# EAGLE design BSPD_Final_1 (EAGLE 9.6.2)
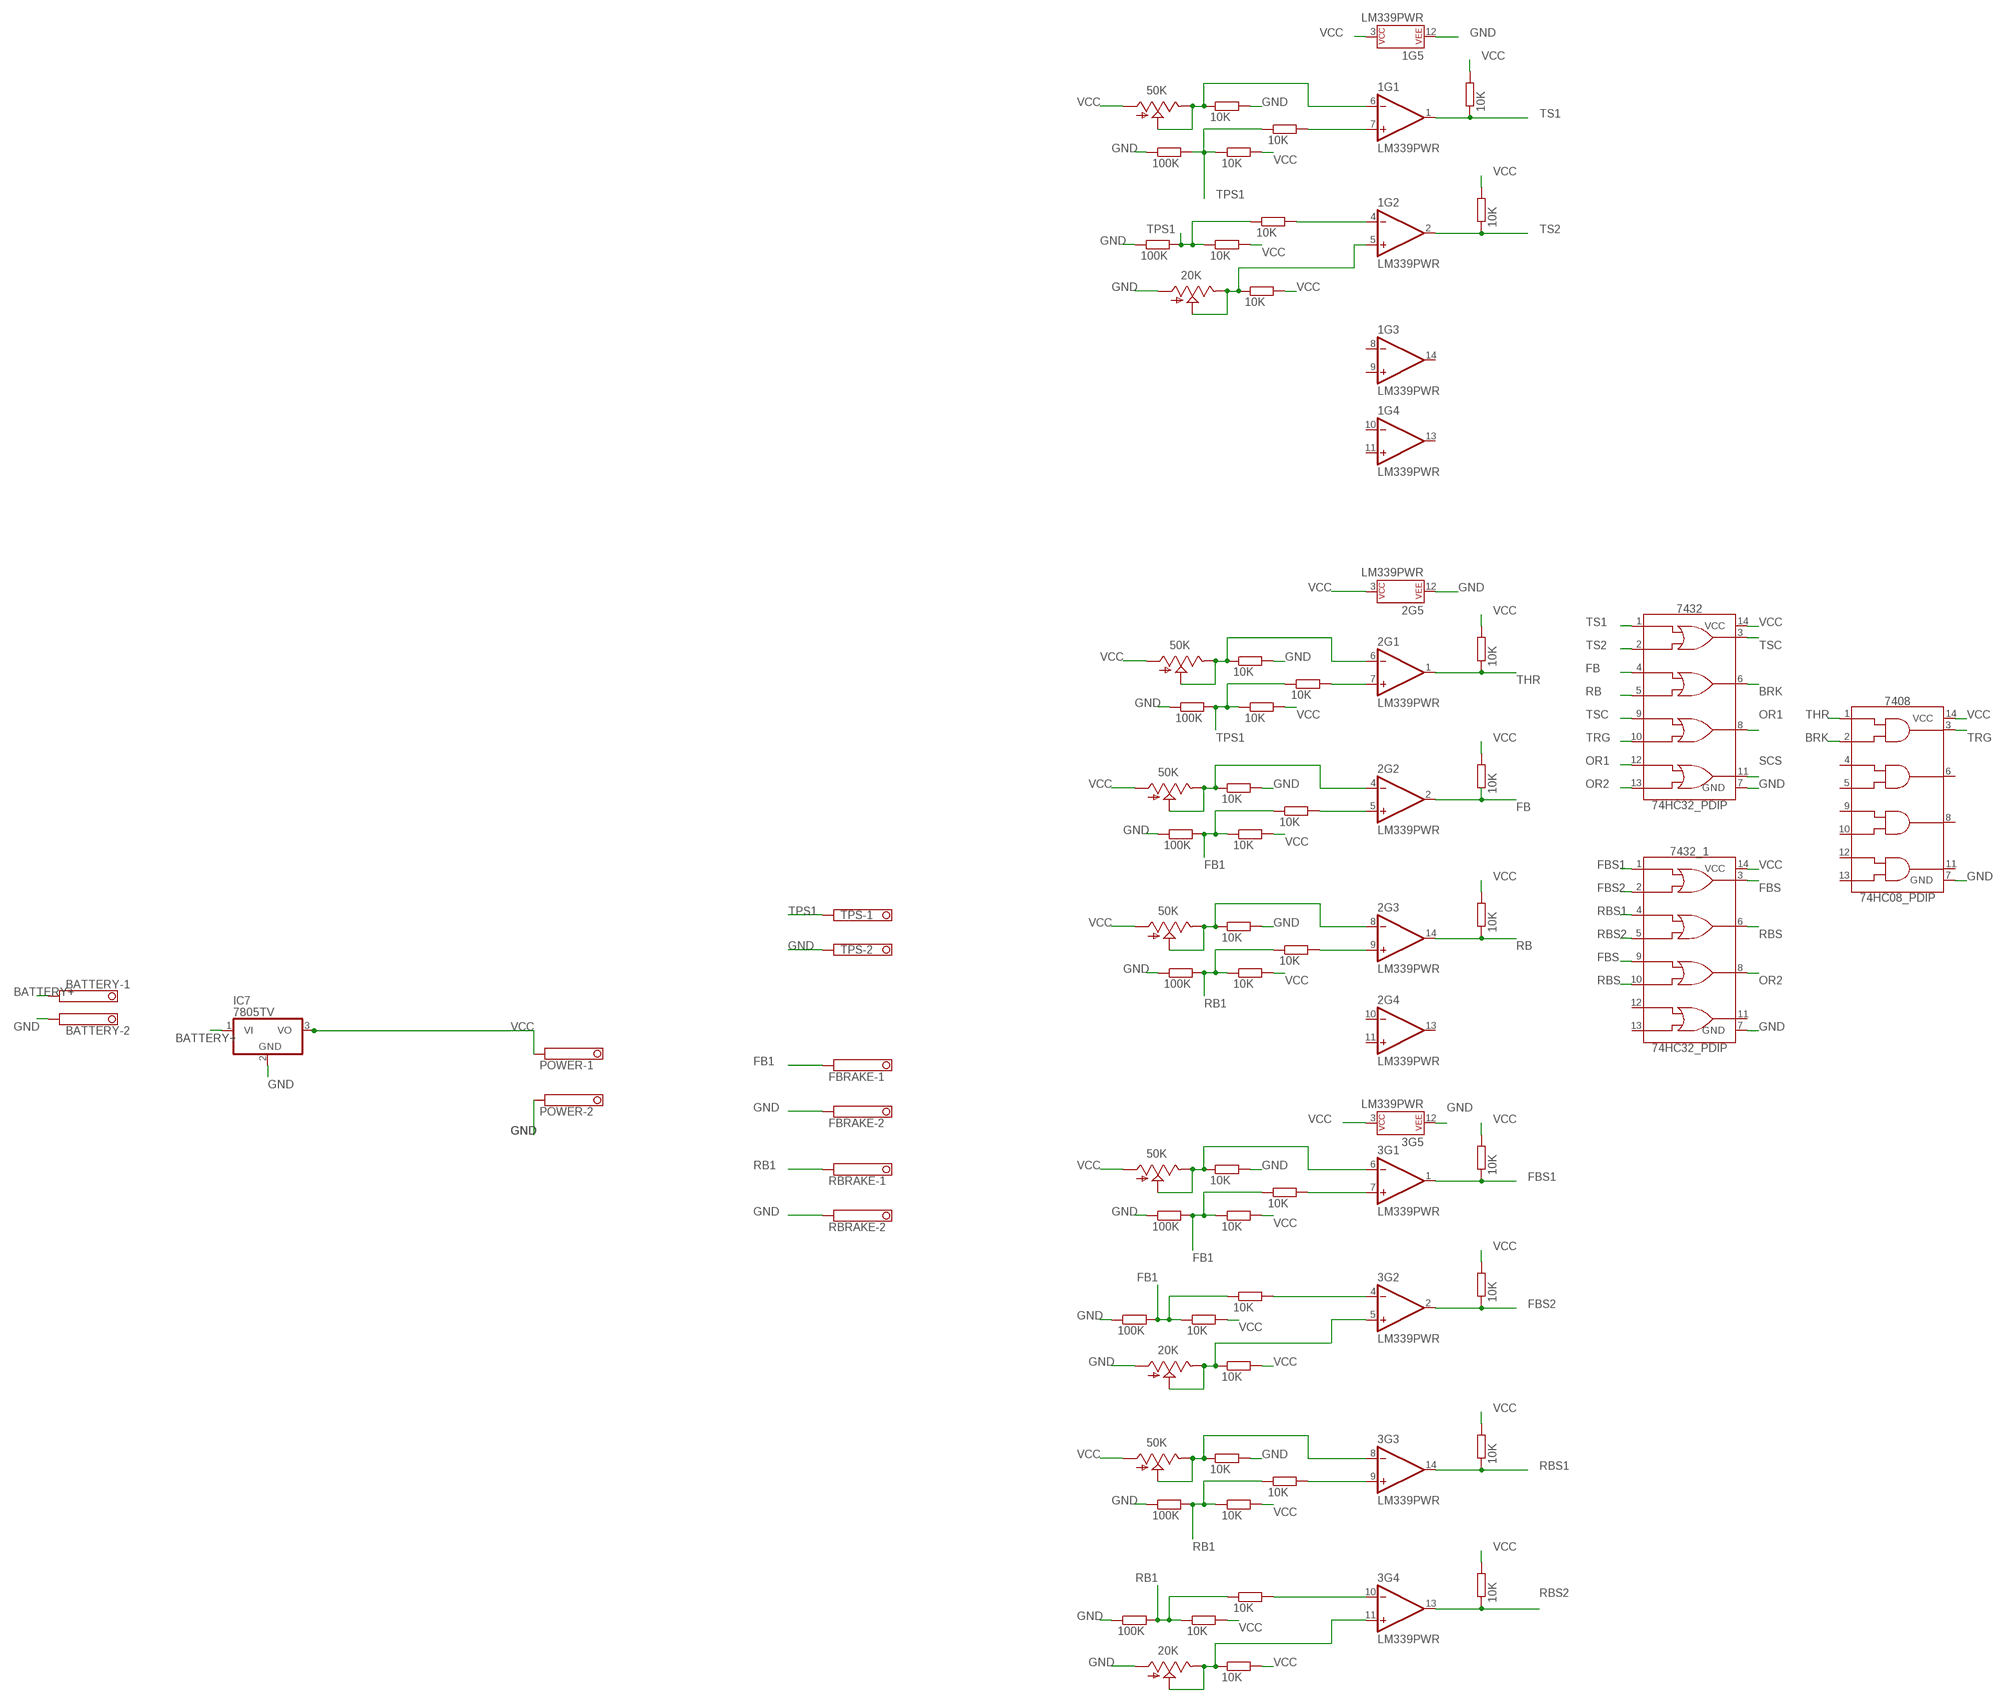
[diagram p0: schematic, sheet 1, part 1 of 2]
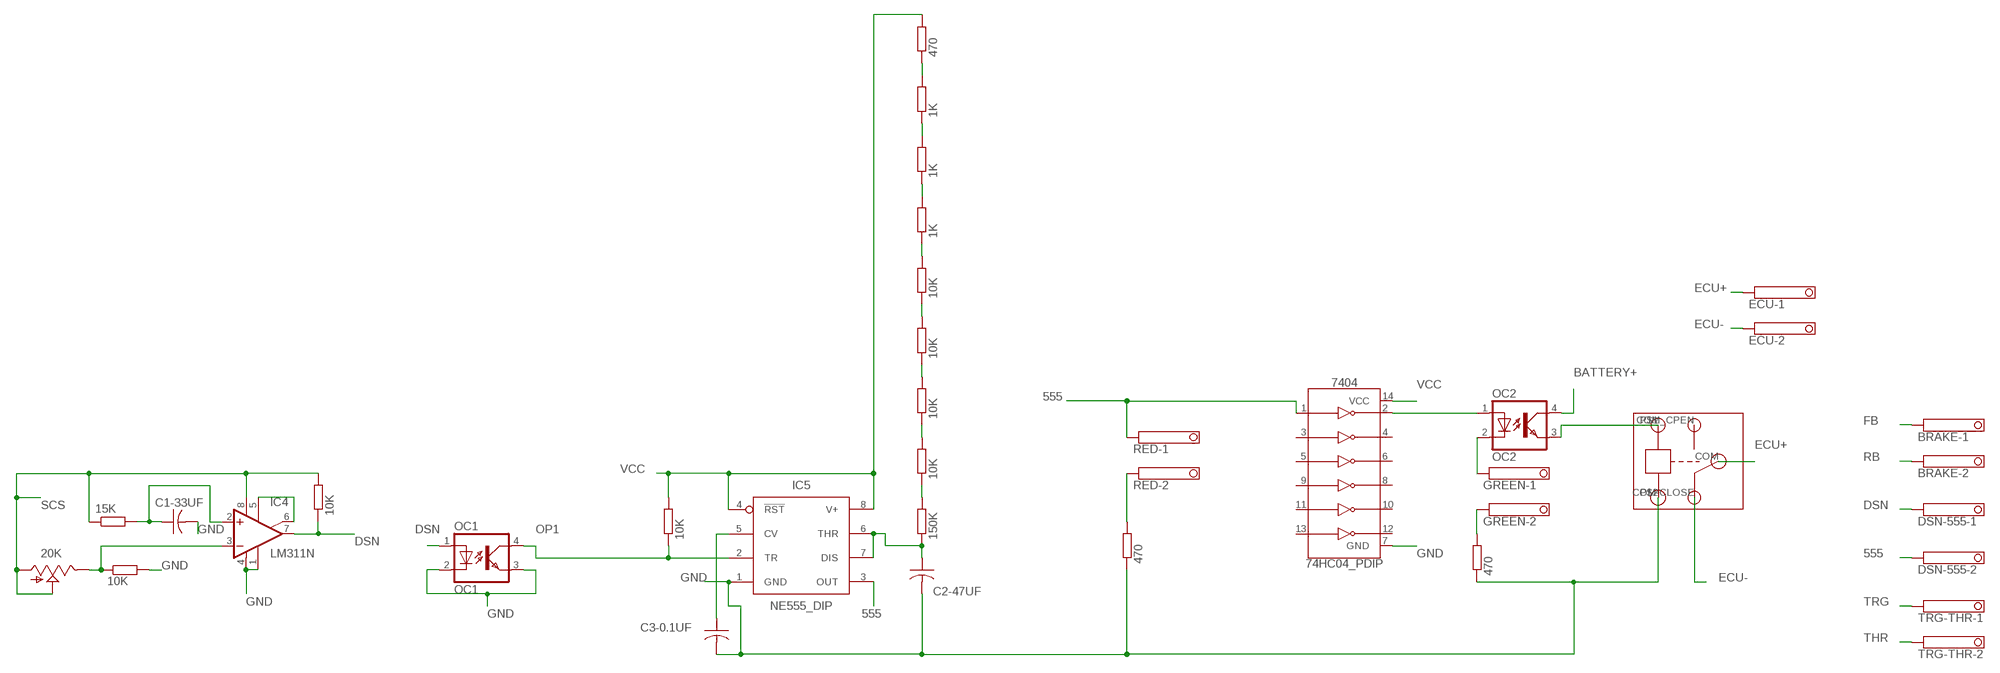
[diagram p1: schematic, sheet 1, part 2 of 2]

## Parts
1  LM339PWR  LM339  [TSSOP-14]
2  LM339PWR  LM339  [TSSOP-14]
3  LM339PWR  LM339  [TSSOP-14]
50K9  20K  TRIM_US-B64Y  [B64Y]
555RES1  150K  R-EU_0207/10  [0207/10]
555RES2  10K  R-EU_0207/10  [0207/10]
555RES3  10K  R-EU_0207/10  [0207/10]
555RES4  10K  R-EU_0207/10  [0207/10]
555RES5  10K  R-EU_0207/10  [0207/10]
555RES6  1K  R-EU_0207/10  [0207/10]
555RES7  1K  R-EU_0207/10  [0207/10]
555RES8  1K  R-EU_0207/10  [0207/10]
555RES9  470  R-EU_0207/10  [0207/10]
7404  74HC04_PDIP  [DIP762W53P254L1969H508Q14B]
7408  74HC08_PDIP  [DIP762W53P254L1969H508Q14B]
7432  74HC32_PDIP  [DIP762W53P254L1969H508Q14B]
7432_1  74HC32_PDIP  [DIP762W53P254L1969H508Q14B]
BATTERY  TERMINAL-BLOCK-3.5MM-2-PIN-ROUND-PAD  [TERMINAL-BLOCK-2-PIN-3.5MM-ROUND-PAD]
BRAKE  TERMINAL-BLOCK-3.5MM-2-PIN-ROUND-PAD  [TERMINAL-BLOCK-2-PIN-3.5MM-ROUND-PAD]
C1-33UF  33uF  ECA-1HM220  [CAP_RADIAL_2MM]
C2-47UF  33uF  ECA-1HM220  [CAP_RADIAL_2MM]
C3-0.1UF  33uF  ECA-1HM220  [CAP_RADIAL_2MM]
DCNPULL  10K  R-EU_0207/10  [0207/10]
DCNRES1  15K  R-EU_0207/10  [0207/10]
DCNRES2  10K  R-EU_0207/10  [0207/10]
DSN-555  TERMINAL-BLOCK-3.5MM-2-PIN-ROUND-PAD  [TERMINAL-BLOCK-2-PIN-3.5MM-ROUND-PAD]
ECU  TERMINAL-BLOCK-3.5MM-2-PIN-ROUND-PAD  [TERMINAL-BLOCK-2-PIN-3.5MM-ROUND-PAD]
FBRAKE  TERMINAL-BLOCK-3.5MM-2-PIN-ROUND-PAD  [TERMINAL-BLOCK-2-PIN-3.5MM-ROUND-PAD]
GREEN  TERMINAL-BLOCK-3.5MM-2-PIN-ROUND-PAD  [TERMINAL-BLOCK-2-PIN-3.5MM-ROUND-PAD]
IC4  LM311N  [DIL08]
IC5  NE555_DIP  [DIP826W53P254L959H508Q8B]
IC7  7805TV  [TO220V]
OC1  OC1  PC817  [DIL04]
OC2  OC2  PC817  [DIL04]
OCTPULL  10K  R-EU_0207/10  [0207/10]
POT1  50K  TRIM_US-B64Y  [B64Y]
POT2  20K  TRIM_US-B64Y  [B64Y]
POT3  50K  TRIM_US-B64Y  [B64Y]
POT4  50K  TRIM_US-B64Y  [B64Y]
POT5  50K  TRIM_US-B64Y  [B64Y]
POT6  50K  TRIM_US-B64Y  [B64Y]
POT7  20K  TRIM_US-B64Y  [B64Y]
POT8  50K  TRIM_US-B64Y  [B64Y]
POT9  20K  TRIM_US-B64Y  [B64Y]
POWER  TERMINAL-BLOCK-3.5MM-2-PIN-ROUND-PAD  [TERMINAL-BLOCK-2-PIN-3.5MM-ROUND-PAD]
PULL1  10K  R-EU_0207/10  [0207/10]
PULL2  10K  R-EU_0207/10  [0207/10]
PULL3  10K  R-EU_0207/10  [0207/10]
PULL4  10K  R-EU_0207/10  [0207/10]
PULL5  10K  R-EU_0207/10  [0207/10]
PULL6  10K  R-EU_0207/10  [0207/10]
PULL7  10K  R-EU_0207/10  [0207/10]
PULL8  10K  R-EU_0207/10  [0207/10]
PULL9  10K  R-EU_0207/10  [0207/10]
R56  470  R-EU_0207/10  [0207/10]
R57  470  R-EU_0207/10  [0207/10]
RBRAKE  TERMINAL-BLOCK-3.5MM-2-PIN-ROUND-PAD  [TERMINAL-BLOCK-2-PIN-3.5MM-ROUND-PAD]
RED  TERMINAL-BLOCK-3.5MM-2-PIN-ROUND-PAD  [TERMINAL-BLOCK-2-PIN-3.5MM-ROUND-PAD]
RES11  10K  R-EU_0207/10  [0207/10]
RES12  10K  R-EU_0207/10  [0207/10]
RES13  100K  R-EU_0207/10  [0207/10]
RES14  10K  R-EU_0207/10  [0207/10]
RES21  10K  R-EU_0207/10  [0207/10]
RES22  10K  R-EU_0207/10  [0207/10]
RES23  10K  R-EU_0207/10  [0207/10]
RES24  100K  R-EU_0207/10  [0207/10]
RES31  10K  R-EU_0207/10  [0207/10]
RES32  10K  R-EU_0207/10  [0207/10]
RES33  100K  R-EU_0207/10  [0207/10]
RES34  10K  R-EU_0207/10  [0207/10]
RES41  10K  R-EU_0207/10  [0207/10]
RES42  10K  R-EU_0207/10  [0207/10]
RES43  100K  R-EU_0207/10  [0207/10]
RES44  10K  R-EU_0207/10  [0207/10]
RES51  10K  R-EU_0207/10  [0207/10]
RES52  10K  R-EU_0207/10  [0207/10]
RES53  100K  R-EU_0207/10  [0207/10]
RES54  10K  R-EU_0207/10  [0207/10]
RES61  10K  R-EU_0207/10  [0207/10]
RES62  10K  R-EU_0207/10  [0207/10]
RES63  100K  R-EU_0207/10  [0207/10]
RES64  10K  R-EU_0207/10  [0207/10]
RES71  10K  R-EU_0207/10  [0207/10]
RES72  10K  R-EU_0207/10  [0207/10]
RES73  100K  R-EU_0207/10  [0207/10]
RES74  10K  R-EU_0207/10  [0207/10]
RES81  10K  R-EU_0207/10  [0207/10]
RES82  10K  R-EU_0207/10  [0207/10]
RES83  100K  R-EU_0207/10  [0207/10]
RES84  10K  R-EU_0207/10  [0207/10]
RES91  10K  R-EU_0207/10  [0207/10]
RES92  10K  R-EU_0207/10  [0207/10]
RES93  100K  R-EU_0207/10  [0207/10]
RES94  10K  R-EU_0207/10  [0207/10]
TPS  TERMINAL-BLOCK-3.5MM-2-PIN-ROUND-PAD  [TERMINAL-BLOCK-2-PIN-3.5MM-ROUND-PAD]
TRG-THR  TERMINAL-BLOCK-3.5MM-2-PIN-ROUND-PAD  [TERMINAL-BLOCK-2-PIN-3.5MM-ROUND-PAD]
U$1  RELAY  [RELAY]

## Nets
555: 7404.1(1A) DSN-555.2 IC5.3(OUT) RED.1
BATTERY+: BATTERY.1 IC7.1(VI) OC2.4(COL)
BRK: 7408.2(1B) 7432.6(2Y)
DSN: DCNPULL.1 DSN-555.1 IC4.7(OUT) OC1.1(A)
ECU+: ECU.1 U$1.COM
ECU-: ECU.2 U$1.COM-CLOSE
FB: 2.2(OUT) 7432.4(2A) BRAKE.1 PULL4.1
FB1: FBRAKE.1 RES41.1 RES42.1 RES43.2 RES61.1 RES62.1 RES63.2 RES71.1 RES72.1 RES73.2
FBS: 7432_1.3(1Y) 7432_1.9(3A)
FBS1: 3.1(OUT) 7432_1.1(1A) PULL6.1
FBS2: 3.2(OUT) 7432_1.2(1B) PULL7.1
GND: 1.12(P$V-) 2.12(P$V-) 3.12(P$V-) 7404.7(GND) 7408.7(GND) 7432.7(GND) 7432_1.7(GND) BATTERY.2 C1-33UF.2 C2-47UF.2 C3-0.1UF.2 DCNRES2.2 FBRAKE.2 IC4.1(GND) IC4.4(V-) IC5.1(GND) IC7.2(GND) OC1.2(C) OC1.3(EMIT) POT2.A POT7.A POT9.A POWER.2 R56.1 R57.1 RBRAKE.2 RES13.1 RES14.2 RES24.1 RES33.1 RES34.2 RES43.1 RES44.2 RES53.1 RES54.2 RES63.1 RES64.2 RES73.1 RES83.1 RES84.2 RES93.1 TPS.2 U$1.P$2(GND)
N$1: 2.7(+IN) RES31.2
N$2: IC4.5(ON) IC4.6(ON/STR)
N$3: 2.6(-IN) POT3.E POT3.S RES34.1
N$4: 2.5(+IN) RES41.2
N$5: 2.4(-IN) POT4.E POT4.S RES44.1
N$6: R56.2 RED.2
N$7: 2.9(+IN) RES51.2
N$8: 2.8(-IN) POT5.E POT5.S RES54.1
N$9: C1-33UF.1 DCNRES1.2 IC4.2(+IN)
N$10: 3.7(+IN) RES61.2
N$11: 3.6(-IN) POT6.E POT6.S RES64.1
N$12: 50K9.E DCNRES2.1 IC4.3(-IN)
N$13: 3.9(+IN) RES81.2
N$14: 3.8(-IN) POT8.E POT8.S RES84.1
N$15: C3-0.1UF.1 IC5.5(CV)
N$16: 1.7(+IN) RES11.2
N$17: 1.6(-IN) POT1.E POT1.S RES14.1
N$19: 1.4(-IN) RES21.2
N$20: 1.5(+IN) POT2.E POT2.S RES23.1
N$21: 555RES1.2 555RES2.1
N$22: 3.4(-IN) RES71.2
N$23: 555RES2.2 555RES3.1
N$24: 3.5(+IN) POT7.E POT7.S RES74.1
N$25: 555RES3.2 555RES4.1
N$26: 3.10(-IN) RES91.2
N$27: 555RES4.2 555RES5.1
N$28: 3.11(+IN) POT9.E POT9.S RES94.1
N$29: 555RES5.2 555RES6.1
N$30: GREEN.2 R57.2
N$31: 7404.2(1Y) OC2.1(A)
N$32: GREEN.1 OC2.2(C)
N$33: OC2.3(EMIT) U$1.P$1(IN)
N$34: 555RES8.2 555RES9.1
N$35: 555RES7.2 555RES8.1
N$36: 555RES6.2 555RES7.1
N$38: 555RES1.1 C2-47UF.1 IC5.6(THR) IC5.7(DIS)
OP1: IC5.2(TR) OC1.4(COL) OCTPULL.1
OR1: 7432.8(3Y) 7432.12(4A)
OR2: 7432.13(4B) 7432_1.8(3Y)
RB: 2.14(OUT) 7432.5(2B) BRAKE.2 PULL5.1
RB1: RBRAKE.1 RES51.1 RES52.1 RES53.2 RES81.1 RES82.1 RES83.2 RES91.1 RES92.1 RES93.2
RBS: 7432_1.6(2Y) 7432_1.10(3B)
RBS1: 3.14(OUT) 7432_1.4(2A) PULL8.1
RBS2: 3.13(OUT) 7432_1.5(2B) PULL9.1
SCS: 50K9.A 50K9.S 7432.11(4Y) DCNPULL.2 DCNRES1.1 IC4.8(V+)
THR: 2.1(OUT) 7408.1(1A) PULL3.1 TRG-THR.2
TPS1: RES11.1 RES12.1 RES13.2 RES21.1 RES22.1 RES24.2 RES31.1 RES32.1 RES33.2 TPS.1
TRG: 7408.3(1Y) 7432.10(3B) TRG-THR.1
TS1: 1.1(OUT) 7432.1(1A) PULL1.1
TS2: 1.2(OUT) 7432.2(1B) PULL2.1
TSC: 7432.3(1Y) 7432.9(3A)
VCC: 1.3(P$V+) 2.3(P$V+) 3.3(P$V+) 555RES9.2 7404.14(VCC) 7408.14(VCC) 7432.14(VCC) 7432_1.14(VCC) IC5.4(!RST) IC5.8(V+) IC7.3(VO) OCTPULL.2 POT1.A POT3.A POT4.A POT5.A POT6.A POT8.A POWER.1 PULL1.2 PULL2.2 PULL3.2 PULL4.2 PULL5.2 PULL6.2 PULL7.2 PULL8.2 PULL9.2 RES12.2 RES22.2 RES23.2 RES32.2 RES42.2 RES52.2 RES62.2 RES72.2 RES74.2 RES82.2 RES92.2 RES94.2
Unconnected: 1.8(-IN) 1.9(+IN) 1.10(-IN) 1.11(+IN) 1.13(OUT) 1.14(OUT) 2.10(-IN) 2.11(+IN) 2.13(OUT) 7404.3(2A) 7404.4(2Y) 7404.5(3A) 7404.6(3Y) 7404.8(4Y) 7404.9(4A) 7404.10(5Y) 7404.11(5A) 7404.12(6Y) 7404.13(6A) 7408.4(2A) 7408.5(2B) 7408.6(2Y) 7408.8(3Y) 7408.9(3A) 7408.10(3B) 7408.11(4Y) 7408.12(4A) 7408.13(4B) 7432_1.11(4Y) 7432_1.12(4A) 7432_1.13(4B) U$1.COM_CPEN(COM-OPEN)

## Library data of the parts
1-3 = SparkFun-IC-Amplifiers:LM339: Quad Comparator - LM339PWR Based on information from the SLCS006N datasheet from TI (www.ti.com). Created by nick@scantool.net, 2008. Updated 2016. SparkFun Products SparkFun OBD-II UART <https://www.sparkfun.com/products/9555> (WIG-09555) SparkFun Car Diagnostics Kit <https://www.sparkfun.com/products/10769> (RTL-10769); PROD_ID: IC-09990
50K9 POT1-POT9 = pot:TRIM_US-: POTENTIOMETER
555RES1-555RES9 DCNPULL DCNRES1 DCNRES2 OCTPULL PULL1-PULL9 R56 R57 RES11-RES14 RES21-RES24 RES31-RES34 RES41-RES44 RES51-RES54 RES61-RES64 RES71-RES74 RES81-RES84 RES91-RES94 = rcl:R-EU_: RESISTOR, European symbol; SPICEPREFIX: R
7404 = IC_Logic:74HC04: Hex Inverters Reference Datasheet <https://www.ti.com/lit/ds/symlink/sn74hc04.pdf?ts=1637607731979&ref_url=https%253A%252F%252Fwww.google.com%252F>; CATEGORY: IC_Logic; DESCRIPTION: Hex Inverters; MANUFACTURER: Generic; MPN: Generic; SUB-CATEGORY: Inverter; TYPE: Hex
7408 = IC_Logic:74HC08: Quadruple 2-Input AND Gates Reference Datasheet <https://www.ti.com/lit/ds/symlink/sn74hc08.pdf?ts=1637607755453&ref_url=https%253A%252F%252Fwww.google.com%252F>; CATEGORY: IC_Logic; DESCRIPTION: Quadruple 2-Input AND Gates; MANUFACTURER: Generic; MPN: Generic; SUB-CATEGORY: GATE; TYPE: AND
7432 7432_1 = IC_Logic:74HC32: Quadruple 2-Input OR Gates Reference Datasheet <https://www.ti.com/lit/ds/symlink/sn54hc32-sp.pdf?ts=1637578080525&ref_url=https%253A%252F%252Fwww.google.com%252F>; CATEGORY: IC_Logic; DESCRIPTION: Quadruple 2-Input OR Gates; MANUFACTURER: Generic; MPN: Generic; SUB-CATEGORY: GATE; TYPE: OR
BATTERY BRAKE DSN-555 ECU FBRAKE GREEN POWER RBRAKE RED TRG-THR = Rembrandt Electronics - Terminal Block 3-5mm v1-0:TERMINAL-BLOCK-3.5MM-2-PIN: Terminal Block 3.5mm Pitch: 3,5 mm Number of pins: 2 Created by Rembrandt Electronics www.rembrandtelectronics.com
C1-33UF C2-47UF C3-0.1UF = Resistor_Capacitor:ECA-1HM220: CAP ALUM 22UF 20% 50V RADIAL Manufacturer's datasheet <https://media.digikey.com/pdf/Data%20Sheets/Panasonic%20Electronic%20Components/ECA-xxM%20Series,TypeA.pdf>; CREATED_BY: PCBLayout.com; DIGIKEY_PART_NUMBER: P5179-ND; MANUFACTURER: Panasonic Electronic Components; MPN: ECA-1HM220; PACKAGE: CAP RADIAL 2MM LS
IC4 = linear:LM311: COMPARATOR
IC5 = IC_Clock-Timing:*555: TIMER 555 General purpose precision timers NE555 : Texas Datasheet <http://www.ti.com/general/docs/suppproductinfo.tsp?distId=10&gotoUrl=http%3A%2F%2Fwww.ti.com%2Flit%2Fgpn%2Fne555>, Diodes Incorporated Datasheet <https://www.diodes.com/assets/Datasheets/NE555_SA555_NA555.pdf> LM555 Datasheet <http://www.ti.com/general/docs/suppproductinfo.tsp?distId=10&gotoUrl=http%3A%2F%2Fwww.ti.com%2Flit%2Fgpn%2Flm555> LMC555 Datasheet <http://www.ti.com/general/docs/suppproductinfo.tsp?distId=10&gotoUrl=http%3A%2F%2Fwww.ti.com%2Flit%2Fgpn%2Flmc555> ICM7555 : Maxim Integrated Datasheet <https://datasheets.maximintegrated.com/en/ds/ICM7555-ICM7556.pdf>, Renesas Electronics America Inc Datasheet <https://www.renesas.com/en-us/www/doc/datasheet/icm7555-56.pdf>; CATEGORY: IC_Clock-Timing; CURRENT-SUPPLY: 10mA; DESCRIPTION: IC OSC SINGLE TIMER 100KHZ 8-DIP; FREQUENCY: 100kHz; MANUFACTURER: Texas Instruments; MPN: NE555P; OPERATING_TEMP: 0°C to 70°C; PART_STATUS: Active; ROHS_COMPLIANT: ROHS3 Compliant; SUB-CATEGORY: Timer
IC7 = linear:78*: Positive VOLTAGE REGULATOR Source: http://cache.national.com/ds/LM/LM78L05.pdf http://www.fairchildsemi.com/ds/LM/LM7805.pdf
OC1 OC2 = optocoupler:PC817: SHARP OPTO COUPLER
TPS = Rembrandt_Electronics_-_Terminal_Block_3-5mm_v1-0:TERMINAL-BLOCK-3.5MM-2-PIN: Terminal Block 3.5mm Pitch: 3,5 mm Number of pins: 2 Created by Rembrandt Electronics www.rembrandtelectronics.com
U$1 = RELAY:RELAY

## Board
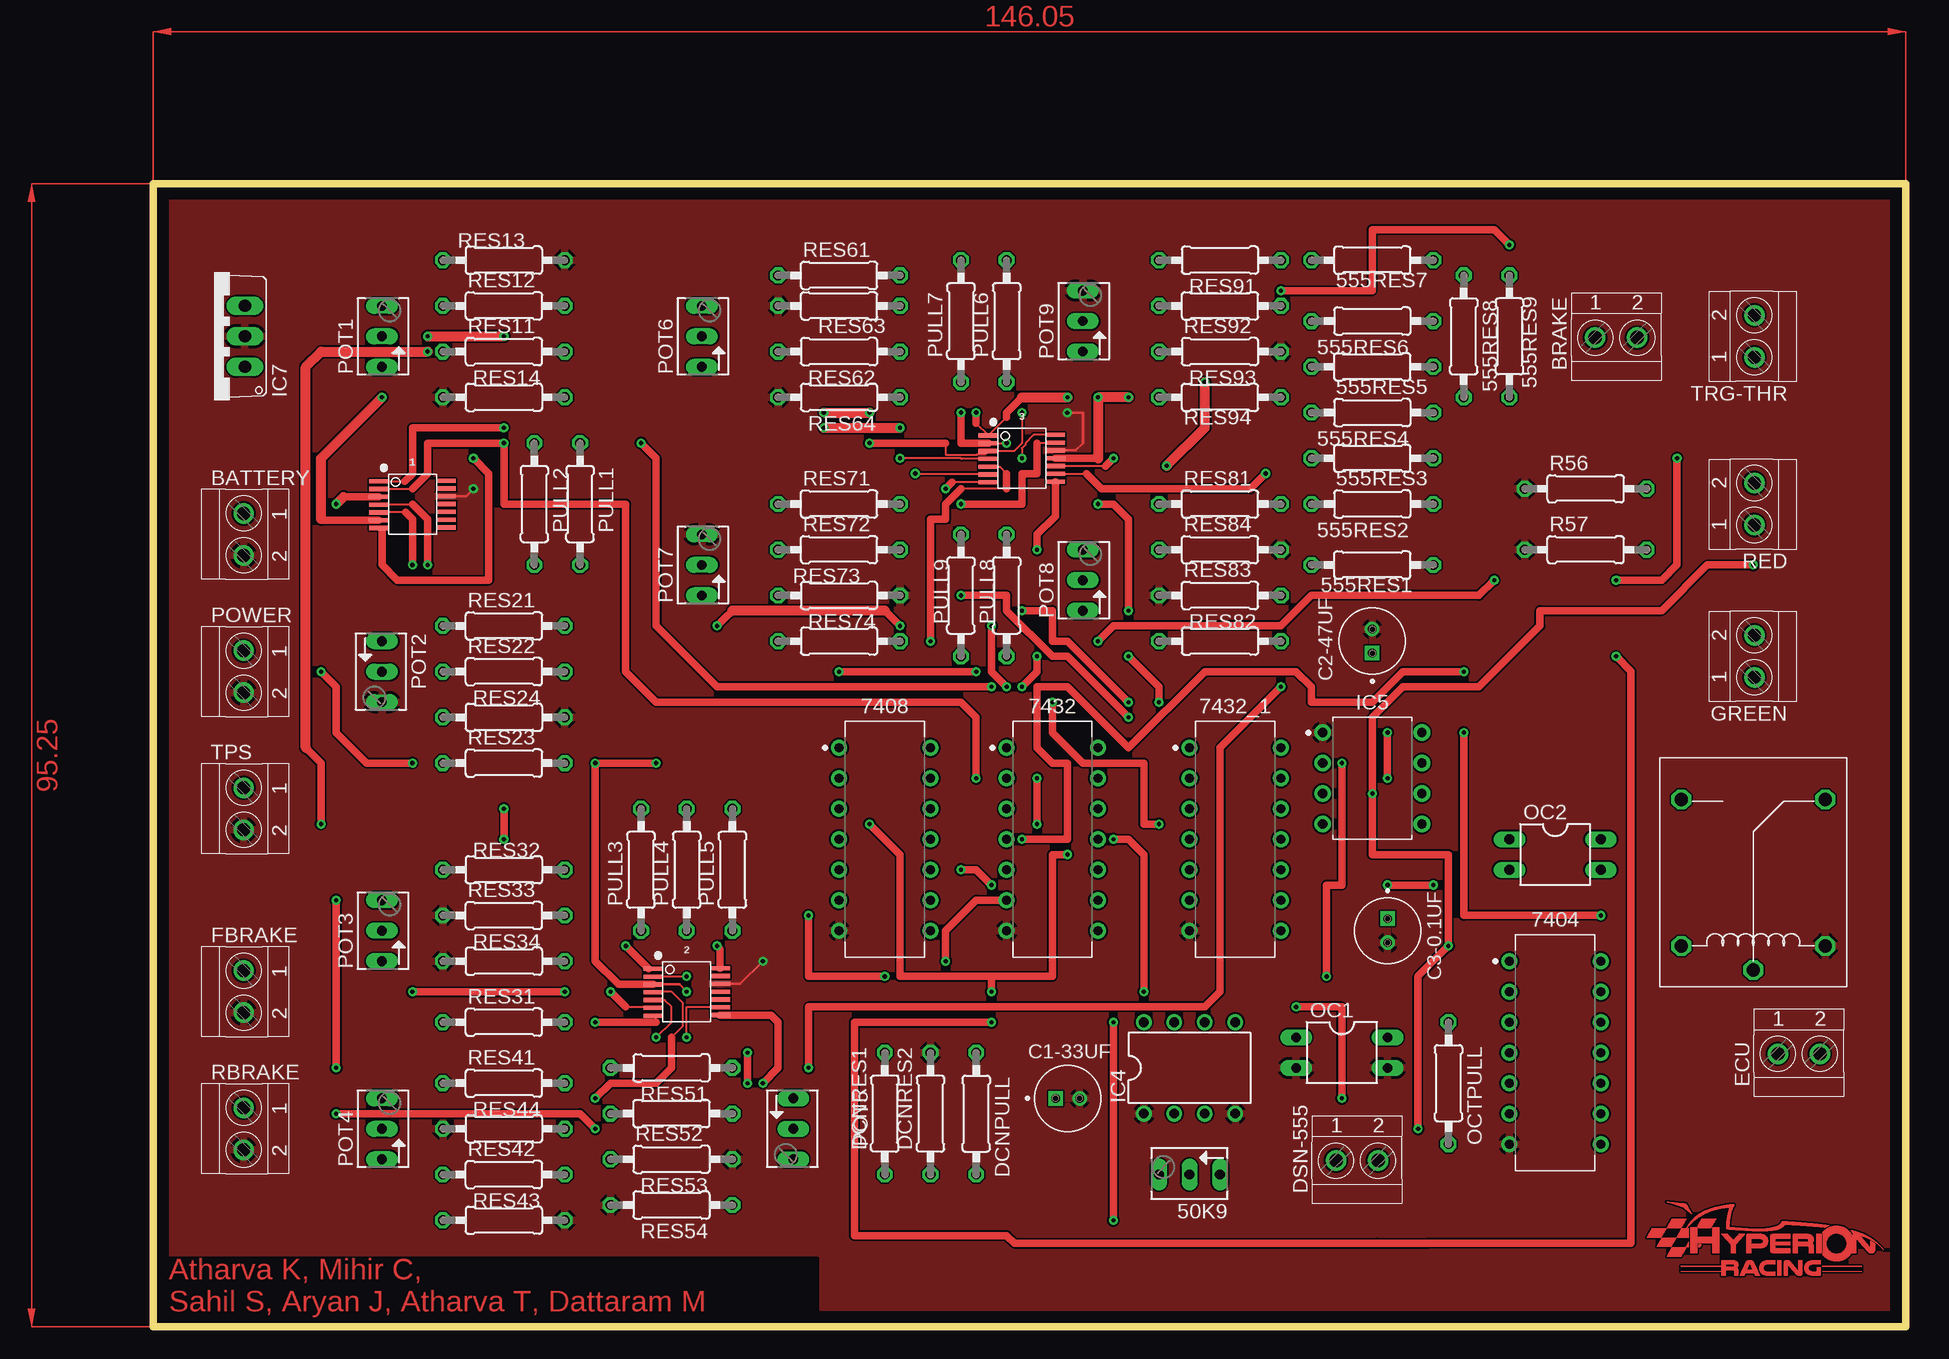
[diagram p2: board, top side]
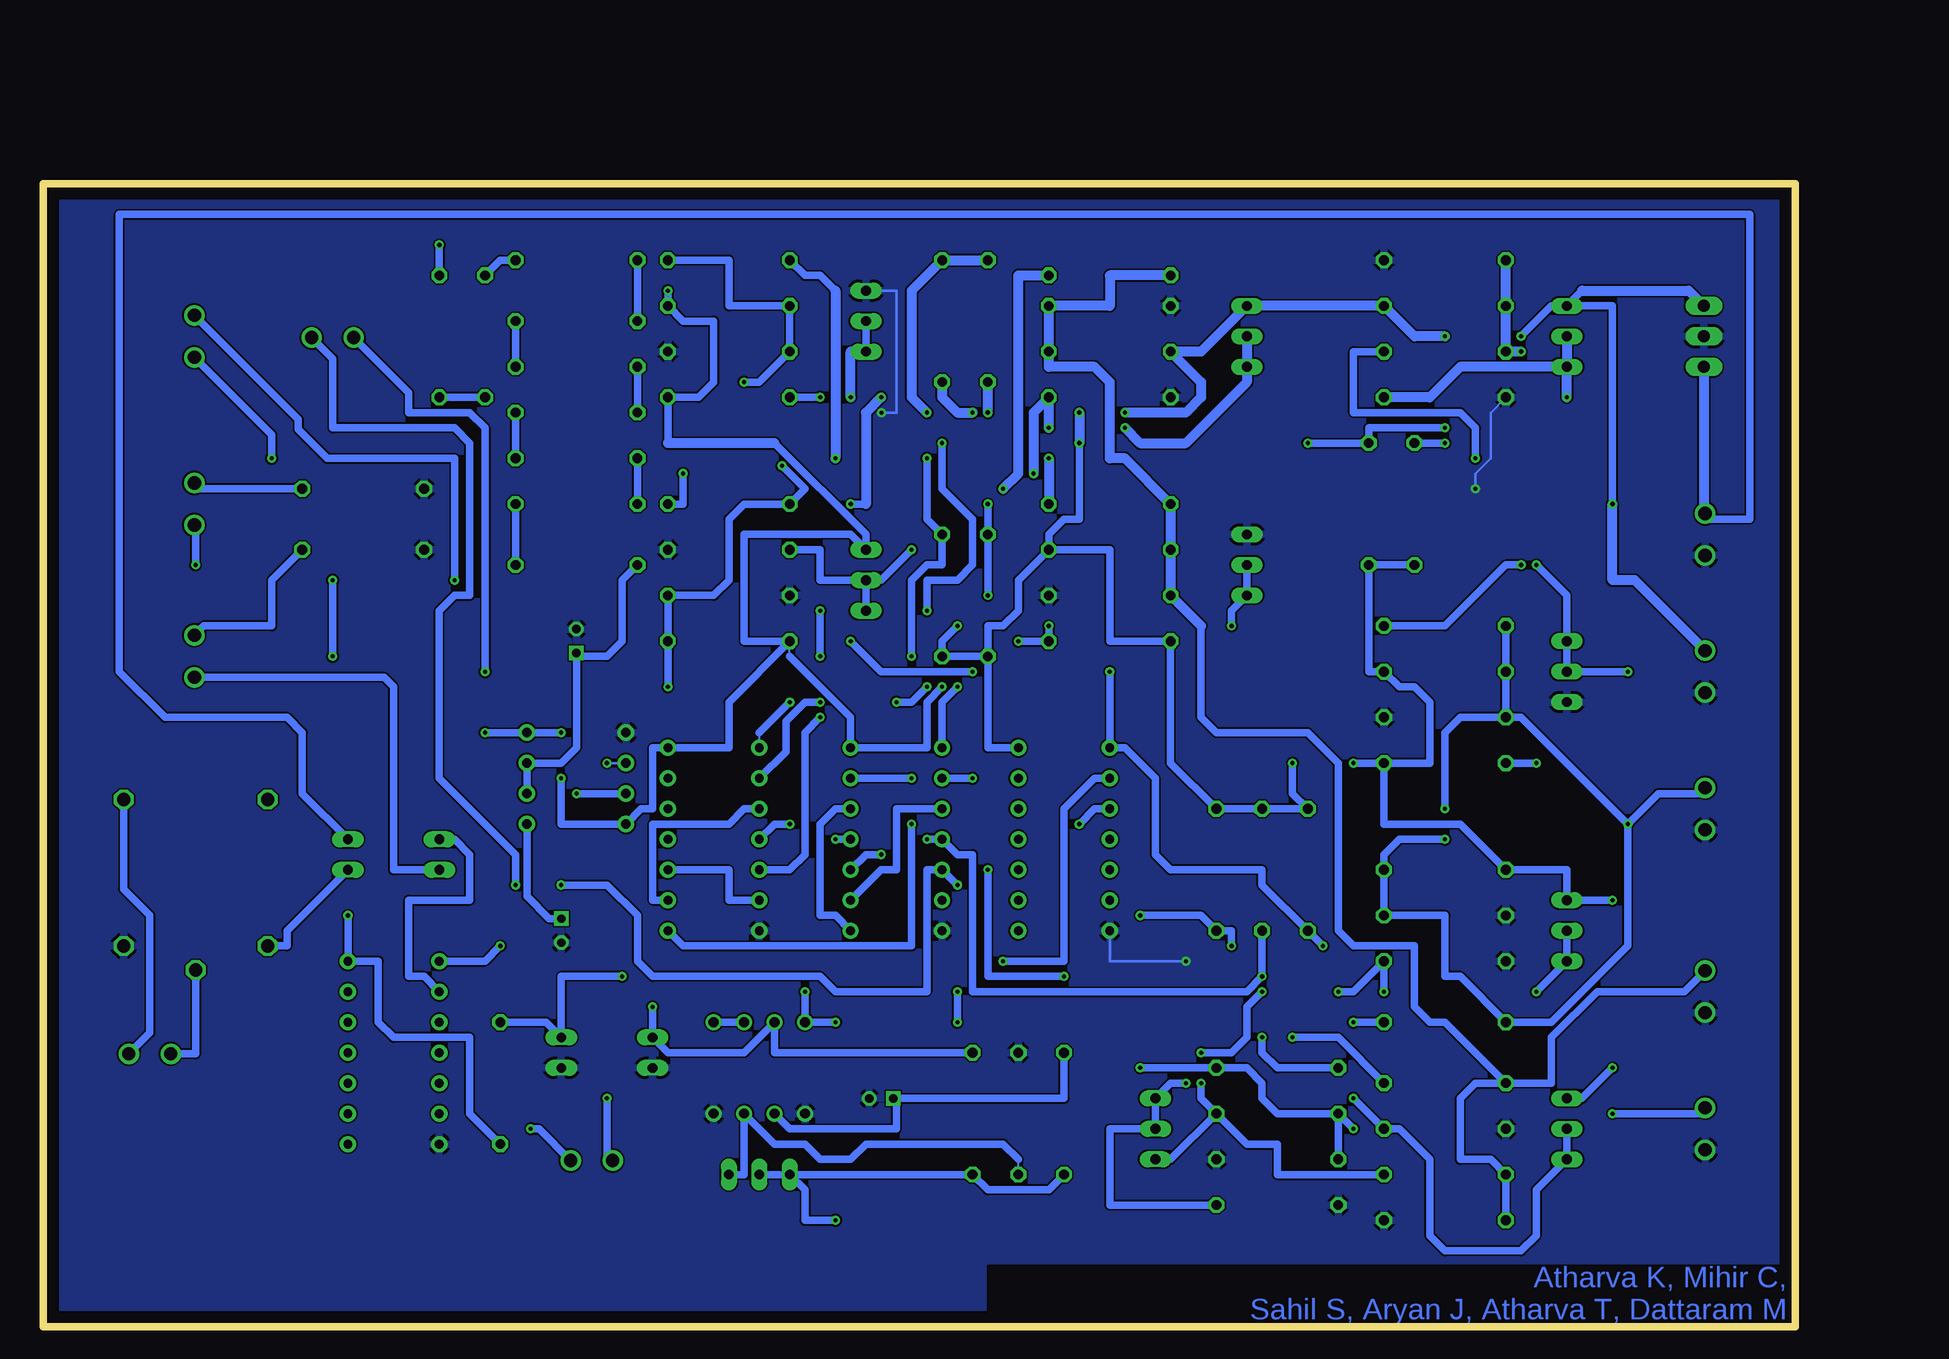
[diagram p3: board, bottom side, seen from below]

Size 146.05 x 95.25 mm. Coordinates in mm from the lower left corner, seen from the top.
Outline: 0,95.25 0,0 146.05,0 146.05,95.25 0,95.25
Copper layers (1*16): Top 0.035mm / dielectric 1.5mm / Bottom 0.035mm
Design rules "default": minimum track width 6mil, minimum drill 0.35mm, track to track 6mil, track to pad 6mil, pad to pad 6mil, via to via 6mil, smd to smd 6mil, copper to edge 40mil, drill to drill 6mil, minimum pad ring 10mil, minimum via ring 8mil, stop-mask expansion 4mil, vias tented up to drill 0mil, thermal gap 10mil

### Footprints (pad centres in the part's own frame; a part is rotated, then mirrored left to right if it is on the bottom)
TSSOP-14 = smd 1.6 x 0.35: 1 -2.8,1.9; 2 -2.8,1.25; 3 -2.8,0.6; 4 -2.8,-0.05; 5 -2.8,-0.7; 6 -2.8,-1.35; 7 -2.8,-2; 8 2.8,-1.95; 9 2.8,-1.3; 10 2.8,-0.65; 11 2.8,0; 12 2.8,0.65; 13 2.8,1.3; 14 2.8,1.95
B64Y = drill 0.813 long: A 2.54,0; E -2.54,0; S 0,0
0207/10 = drill 0.813 octagon: 1 -5.08,0; 2 5.08,0
DIP762W53P254L1969H508Q14B = drill 0.743 pad 1.343: 1 -3.81,7.62; 2 -3.81,5.08; 3 -3.81,2.54; 4 -3.81,0; 5 -3.81,-2.54; 6 -3.81,-5.08; 7 -3.81,-7.62; 8 3.81,-7.62; 9 3.81,-5.08; 10 3.81,-2.54; 11 3.81,0; 12 3.81,2.54; 13 3.81,5.08; 14 3.81,7.62
TERMINAL-BLOCK-2-PIN-3.5MM-ROUND-PAD = drill 1.1 pad 1.7: 1 -1.75,-0.1; 2 1.75,-0.1
CAP_RADIAL_2MM = drill 0.7 pad 1.1 square: 1 -1,0 | drill 0.7 pad 1.1: 2 1,0
DIL08 = drill 0.813 pad 1.27: 1 -3.81,-3.81; 2 -1.27,-3.81; 3 1.27,-3.81; 4 3.81,-3.81; 5 3.81,3.81; 6 1.27,3.81; 7 -1.27,3.81; 8 -3.81,3.81
DIP826W53P254L959H508Q8B = drill 0.786 pad 1.386: 1 -4.13,3.81; 2 -4.13,1.27; 3 -4.13,-1.27; 4 -4.13,-3.81; 5 4.13,-3.81; 6 4.13,-1.27; 7 4.13,1.27; 8 4.13,3.81
TO220V = drill 1.016 long: 1 -2.54,-2.54; 2 0,-2.54; 3 2.54,-2.54
DIL04 = drill 0.813 long: 1 -1.27,-3.81; 2 1.27,-3.81; 3 1.27,3.81; 4 -1.27,3.81
RELAY = drill 1.1 octagon: COM -2,0; COM-CLOSE 12.2,-6; COM_CPEN 12.2,6; P$1 0,6; P$2 0,-6

### Placement (x,y rotation side)
1  21.59,68.58 0 top
2  44.45,27.94 0 top
3  72.39,72.39 0 top
50K9  86.36,12.7 180 top
555RES1  101.6,63.5 0 top
555RES2  101.6,68.58 180 top
555RES3  101.6,72.39 0 top
555RES4  101.6,76.2 180 top
555RES5  101.6,80.01 0 top
555RES6  101.6,83.82 180 top
555RES7  101.6,88.9 0 top
555RES8  109.22,82.55 270 top
555RES9  113.03,82.55 90 top
7404  116.84,22.86 0 top
7408  60.96,40.64 0 top
7432  74.93,40.64 0 top
7432_1  90.17,40.64 0 top
BATTERY  7.62,66.04 270 top
BRAKE  121.92,82.55 0 top
C1-33UF  76.2,19.05 0 top
C2-47UF  101.6,57.15 90 top
C3-0.1UF  102.87,33.02 270 top
DCNPULL  68.58,17.78 270 top
DCNRES1  60.96,17.78 90 top
DCNRES2  64.77,17.78 90 top
DSN-555  100.33,13.97 0 top
ECU  137.16,22.86 0 top
FBRAKE  7.62,27.94 270 top
GREEN  133.35,55.88 90 top
IC4  86.36,21.59 0 top
IC5  101.6,45.72 0 top
IC7  5.08,82.55 90 top
OC1  99.06,22.86 270 top
OC2  116.84,39.37 270 top
OCTPULL  107.95,20.32 270 top
POT1  19.05,82.55 90 top
POT2  19.05,54.61 270 top
POT3  19.05,33.02 90 top
POT4  19.05,16.51 90 top
POT5  53.34,16.51 270 top
POT6  45.72,82.55 90 top
POT7  45.72,63.5 90 top
POT8  77.47,62.23 90 top
POT9  77.47,83.82 90 top
POWER  7.62,54.61 270 top
PULL1  35.56,68.58 270 top
PULL2  31.75,68.58 270 top
PULL3  40.64,38.1 90 top
PULL4  44.45,38.1 90 top
PULL5  48.26,38.1 90 top
PULL6  71.12,83.82 90 top
PULL7  67.31,83.82 90 top
PULL8  71.12,60.96 270 top
PULL9  67.31,60.96 270 top
R56  119.38,69.85 0 top
R57  119.38,64.77 0 top
RBRAKE  7.62,16.51 270 top
RED  133.35,68.58 90 top
RES11  29.21,81.28 0 top
RES12  29.21,85.09 0 top
RES13  29.21,88.9 180 top
RES14  29.21,77.47 180 top
RES21  29.21,58.42 0 top
RES22  29.21,54.61 0 top
RES23  29.21,46.99 0 top
RES24  29.21,50.8 180 top
RES31  29.21,25.4 0 top
RES32  29.21,38.1 180 top
RES33  29.21,34.29 0 top
RES34  29.21,30.48 180 top
RES41  29.21,20.32 0 top
RES42  29.21,12.7 0 top
RES43  29.21,8.89 180 top
RES44  29.21,16.51 180 top
RES51  43.18,21.59 180 top
RES52  43.18,17.78 0 top
RES53  43.18,13.97 180 top
RES54  43.18,10.16 180 top
RES61  57.15,87.63 0 top
RES62  57.15,81.28 180 top
RES63  57.15,85.09 0 top
RES64  57.15,77.47 180 top
RES71  57.15,68.58 0 top
RES72  57.15,64.77 0 top
RES73  57.15,60.96 180 top
RES74  57.15,57.15 180 top
RES81  88.9,68.58 0 top
RES82  88.9,57.15 180 top
RES83  88.9,60.96 0 top
RES84  88.9,64.77 0 top
RES91  88.9,88.9 180 top
RES92  88.9,85.09 0 top
RES93  88.9,81.28 180 top
RES94  88.9,77.47 0 top
TPS  7.62,43.18 270 top
TRG-THR  133.35,82.55 90 top
U$1  133.35,31.75 90 top

### Tracks (layer width: path | path; a pad name or v marks a point on that pad's centre or on a via)
555  (via drill 0.35)
  Top 0.61: v133.35,63.5 129.54,63.5 125.73,59.69 115.57,59.69 115.57,58.42 110.49,53.34 104.14,53.34 101.6,50.8 v101.6,44.45 101.6,39.37 107.95,39.37 v107.95,31.75 105.41,29.21 v105.41,16.51
  Bottom 0.152: 133.35,66.73 RED.1
  Bottom 0.61: 7404.1 109.22,30.48 v107.95,31.75 | v101.6,44.45 IC5.3 | v133.35,63.5 133.35,66.73 | DSN-555.2 104.72,16.51 v105.41,16.51
BATTERY+
  Bottom 0.152: 7.62,67.89 BATTERY.1
  Bottom 0.61: OC2.4 124.46,44.45 124.46,49.53 125.73,50.8 135.89,50.8 139.7,54.61 139.7,92.71 3.81,92.71 3.81,67.31 7.04,67.31 BATTERY.1
  Bottom 0.813: IC7.1 7.62,67.89
BRK  (via drill 0.35)
  Top 0.61: v66.04,30.48 66.04,33.02 68.58,35.56 7432.6
  Bottom 0.61: 7408.2 58.42,45.72 60.96,43.18 60.96,30.48 v66.04,30.48
DSN  (via drill 0.35)
  Top 0.61: v99.06,19.05 99.06,26.67 v95.25,26.67
  Bottom 0.61: DCNPULL.1 85.09,22.86 IC4.7 87.63,22.86 93.98,22.86 OC1.1 v95.25,26.67 | DSN-555.1 99.06,14.35 v99.06,19.05
ECU+
  Bottom 0.61: U$1.COM 133.35,22.76 ECU.1
ECU-
  Bottom 0.61: U$1.COM-CLOSE 139.35,36.48 137.16,34.29 137.16,24.51 ECU.2
FB  (via drill 0.35)
  Top 0.152: v44.45,29.21 44.43,29.19 2.2
  Top 0.61: v109.22,54.61 104.14,54.61 101.6,52.07 96.52,52.07 96.52,53.34 95.25,54.61 87.63,54.61 81.28,48.26 76.2,53.34 73.66,53.34 73.66,48.26 74.93,46.99 76.2,46.99 76.2,40.64 v72.39,40.64
  Bottom 0.61: PULL4.1 v44.45,29.21 45.72,27.94 68.58,27.94 68.58,39.37 69.85,39.37 7432.4 v72.39,40.64 | BRAKE.1 115.57,77.85 115.57,76.2 110.49,76.2 109.22,74.93 v109.22,54.61
FB1
  Bottom 0.61: RES43.2 RES42.1 25.4,13.97 27.94,13.97 27.94,19.05 26.67,20.32 RES41.1 | FBRAKE.1 9.27,27.94 16.51,27.94 20.32,24.13 20.32,20.32 RES41.1 | RES41.1 29.21,25.4 30.48,25.4 31.75,26.67 31.75,31.75 36.83,31.75 38.1,33.02 38.1,46.99 40.64,49.53 48.26,49.53 49.53,50.8 49.53,58.42
  Bottom 0.813: RES61.1 57.15,87.63 57.15,85.09 RES63.2 RES62.1 62.23,80.01 58.42,80.01 57.15,78.74 57.15,72.39 55.88,72.39 RES71.1 RES72.1 RES73.2 49.53,58.42
FBS
  Bottom 0.61: 7432_1.3 87.63,43.18 88.9,41.91 95.25,41.91 95.25,35.56 7432_1.9
FBS1  (via drill 0.35)
  Top 0.152: 68.58,75.3 3.1 71.12,75.82
  Top 0.61: v68.58,76.2 68.58,75.3 | 71.12,75.82 71.12,76.2 72.39,77.47 | v78.74,68.58 80.01,68.58 81.28,67.31 v81.28,59.69 | v81.28,55.88 83.82,53.34 v83.82,52.07
  Top 0.813: 72.39,77.47 v76.2,77.47
  Bottom 0.152: 86.36,49.53 7432_1.1
  Bottom 0.61: 77.47,68.58 v78.74,68.58 | v81.28,59.69 v81.28,55.88 | v83.82,52.07 86.36,49.53
  Bottom 0.813: PULL6.1 71.12,77.47 69.85,76.2 v68.58,76.2 | v76.2,77.47 77.47,76.2 77.47,68.58
FBS2  (via drill 0.35)
  Top 0.152: 67.33,73.64 67.31,73.66 | 3.2 69.61,73.66 v71.12,73.66
  Top 0.61: 3.2 67.33,73.64 | 67.31,73.66 v67.31,76.2 | v72.39,59.69 74.93,59.69 74.93,57.15 76.2,57.15 v81.28,52.07
  Bottom 0.61: v72.39,59.69 72.39,62.23 69.85,62.23 68.58,63.5 68.58,67.31 71.12,69.85 v71.12,73.66 | 7432_1.2 84.15,47.93 84.15,50.47 82.55,52.07 v81.28,52.07
  Bottom 0.813: v67.31,76.2 PULL7.1
GND  (via drill 0.35)
  Top 0.203: v26.67,69.85 26.05,69.23 1.12 | v76.17,76.17 76.2,76.2 77.47,76.2 77.47,73.66 76.85,73.04 3.12 | 2.12 48.91,28.59 v50.8,30.48
  Bottom 0.203: RES14.2 25.4,76.2 25.4,72.39 26.67,71.12 v26.67,69.85 | POT9.A 74.93,86.36 74.93,76.2 74.96,76.17 v76.17,76.17 | v50.8,30.48 57.15,30.48 7408.7
  pour Bottom: 0,95.25 0,0 146.05,0 146.05,95.25
  pour Top: 0,95.25 0,0 146.05,0 146.05,95.25
N$1  (via drill 0.35)
  Top 0.152: 41.91,25.4 41.91,25.68 2.7
  Top 0.61: v36.83,25.4 41.91,25.4
  Bottom 0.61: RES31.2 v36.83,25.4
N$2
  Bottom 0.61: IC4.6 IC4.5
N$3  (via drill 0.35)
  Top 0.152: 2.6 41.57,26.67 39.37,26.67
  Top 0.61: v38.1,27.94 39.37,26.67 | v21.59,27.94 v34.29,27.94
  Bottom 0.61: POT3.S POT3.E v21.59,27.94 | v38.1,27.94 36.83,27.94 RES34.1 v34.29,27.94
N$4  (via drill 0.35)
  Top 0.152: v41.91,24.13 43.18,25.4 43.18,26.67 42.61,27.24 2.5
  Bottom 0.61: RES41.2 38.1,24.13 v41.91,24.13
N$5  (via drill 0.35)
  Top 0.152: 43.18,24.13 44.14,25.1 44.14,26.97 43.18,27.94 41.7,27.94 2.4
  Top 0.61: v36.83,19.05 38.1,20.32 41.91,20.32 43.18,21.59 43.18,24.13
  Bottom 0.61: POT4.S POT4.E 21.59,11.43 21.59,7.62 22.86,6.35 29.21,6.35 30.48,7.62 30.48,13.97 33.02,16.51 RES44.1 v36.83,19.05
N$6
  Bottom 0.152: 133.35,69.85 133.45,69.95 RED.2
  Bottom 0.61: R56.2 133.35,69.85
N$7  (via drill 0.35)
  Top 0.152: v44.45,24.13 44.45,26.67 47.22,26.67 2.9
  Bottom 0.61: RES51.2 43.18,21.59 44.45,22.86 v44.45,24.13
N$8  (via drill 0.35)
  Top 0.61: 2.8 51.48,25.99 52.07,25.4 52.07,21.59 v50.8,20.32
  Bottom 0.61: RES54.1 57.15,10.16 57.15,16.51 POT5.S POT5.E 52.07,20.32 v50.8,20.32
N$9
  Bottom 0.152: 74.93,18.78 C1-33UF.1
  Bottom 0.61: IC4.2 83.82,16.51 74.93,16.51 74.93,18.78 | C1-33UF.1 60.96,19.05 DCNRES1.2
N$10  (via drill 0.35)
  Top 0.152: 3.7 66.58,70.39
  Top 0.61: 66.58,70.39 v66.04,69.85
  Bottom 0.813: v66.04,69.85 64.77,71.12 64.77,87.63 RES61.2
N$11  (via drill 0.35)
  Top 0.152: v63.5,71.12 69.51,71.12 3.6
  Top 0.813: v55.88,74.93 v62.23,74.93
  Bottom 0.813: POT6.S POT6.E 45.72,78.74 50.8,73.66 54.61,73.66 v55.88,74.93 | v63.5,71.12 63.5,76.2 RES64.1 v62.23,74.93
N$12
  Bottom 0.152: DCNRES2.1 64.77,13.97
  Bottom 0.61: 50K9.E 87.63,12.7 IC4.3 85.09,15.24 82.55,15.24 81.28,13.97 78.74,13.97 77.47,15.24 66.04,15.24 64.77,13.97
N$13  (via drill 0.35)
  Top 0.152: 3.9 77.79,71.09
  Top 0.61: 77.79,71.09 79.03,69.85 91.44,69.85 v92.71,71.12
  Bottom 0.61: v92.71,71.12 92.71,68.58 RES81.2
N$14  (via drill 0.35)
  Top 0.61: 3.8 75.19,67.57 73.66,66.04 v73.66,64.77
  Bottom 0.61: POT8.E POT8.S | POT8.S 81.28,62.23 81.28,64.77 RES84.1 | v73.66,64.77 76.2,62.23 POT8.S
N$15
  Bottom 0.61: IC5.5 105.73,35.88 103.87,34.02 C3-0.1UF.1
N$16  (via drill 0.35)
  Top 0.203: 1.7 19.05,66.32
  Top 0.61: 19.05,66.32 19.05,63.5 20.32,62.23 27.94,62.23 27.94,71.12 v26.67,72.39
  Bottom 0.61: v26.67,72.39 26.67,74.93 27.94,76.2 36.83,76.2 36.83,81.28 RES11.2
N$17  (via drill 0.35)
  Top 0.203: 14.05,67.23 13.97,67.31
  Top 0.61: 1.6 14.05,67.23
  Top 0.813: 13.97,67.31 13.97,72.39 v19.05,77.47
  Bottom 0.813: POT1.S POT1.E | POT1.E 27.94,80.01 30.48,77.47 RES14.1 | v19.05,77.47 POT1.E
N$19  (via drill 0.35)
  Top 0.152: 1.4 18.84,68.58 21.59,68.58
  Top 0.61: 21.59,68.58 22.86,67.31 v22.86,63.5
  Bottom 0.61: v22.86,63.5 24.13,63.5 29.21,58.42 RES21.2
N$20  (via drill 0.35)
  Top 0.152: 21.02,67.88 1.5
  Top 0.61: v21.59,46.99 17.78,46.99 15.24,49.53 15.24,53.34 v13.97,54.61 | v21.59,63.5 21.59,67.31 21.02,67.88
  Bottom 0.61: RES23.1 v21.59,46.99 | v13.97,54.61 POT2.S POT2.E 19.05,60.96 v21.59,63.5
N$21
  Bottom 0.61: 555RES2.1 555RES1.2
N$22  (via drill 0.35)
  Top 0.152: 3.4 67.36,72.34 67.31,72.39 v62.23,72.39
  Bottom 0.813: v62.23,72.39 RES71.2
N$23
  Bottom 0.61: 555RES2.2 555RES3.1
N$24  (via drill 0.35)
  Top 0.152: 3.5 70.55,71.69 71.12,71.12 | 71.12,69.85 67.31,69.85
  Top 0.61: 71.12,71.12 71.12,69.85 | 67.31,69.85 66.04,68.58 66.04,67.31 64.77,67.31 v64.77,57.15 | v46.99,58.42 47.62,59.06 48.26,59.69 | 60.96,59.69 v62.23,58.42
  Top 0.813: 60.96,59.69 48.26,59.69
  Bottom 0.61: POT7.S POT7.E 46.99,59.69 v46.99,58.42 | v64.77,57.15 RES74.1 v62.23,58.42
N$25
  Bottom 0.61: 555RES3.2 555RES4.1
N$26  (via drill 0.35)
  Top 0.152: 79.36,71.74 3.10
  Top 0.61: v80.01,72.39 79.36,71.74
  Bottom 0.61: RES91.2 82.55,87.63 81.28,87.63 80.01,86.36
  Bottom 0.813: 80.01,86.36 v80.01,72.39
N$27
  Bottom 0.61: 555RES4.2 555RES5.1
N$28  (via drill 0.35)
  Top 0.61: 78.74,72.39 3.11
  Top 0.813: v81.28,77.47 v78.74,77.47 78.74,72.39
  Bottom 0.61: POT9.S POT9.E 78.74,81.28 | RES94.1 v81.28,77.47
  Bottom 0.813: v78.74,77.47 78.74,81.28
N$29
  Bottom 0.61: 555RES5.2 555RES6.1
N$30
  Bottom 0.61: R57.2 127,62.23 127,58.42 132.66,58.42 GREEN.2
N$31
  Bottom 0.152: 111.76,40.64 OC2.1
  Bottom 0.61: 7404.2 114.3,29.21 115.57,29.21 115.57,35.56 110.49,35.56 110.49,39.37 111.76,40.64
N$32
  Bottom 0.61: OC2.2 116.84,38.1 116.84,53.34 117.63,54.13 GREEN.1
N$33
  Bottom 0.61: OC2.3 125.73,33.02 125.73,31.75 U$1.P$1
N$34
  Bottom 0.61: 555RES8.2 555RES9.1
N$35
  Bottom 0.61: 555RES8.1 107.95,88.9 555RES7.2
N$36
  Bottom 0.61: 555RES6.2 555RES7.1
N$38
  Bottom 0.152: C2-47UF.1 101.6,55.88 | IC5.7 105.41,46.99 105.73,46.67
  Bottom 0.61: 105.41,46.99 102.87,46.99 101.6,48.26 101.6,55.88 99.06,55.88 97.79,57.15 97.79,62.23 555RES1.1 | IC5.6 105.73,46.67
OP1  (via drill 0.35)
  Top 0.61: v99.06,46.99 99.06,36.83 97.79,36.83 v97.79,29.21
  Bottom 0.203: IC5.2 v99.06,46.99
  Bottom 0.61: OCTPULL.1 104.14,25.4 OC1.4 102.87,29.21 v97.79,29.21
OR1
  Bottom 0.61: 7432.8 80.01,34.29 81.28,34.29 81.28,41.91 80.01,43.18 7432.12
OR2  (via drill 0.35)
  Top 0.61: v73.66,41.91 v73.66,45.72
  Bottom 0.61: 7432_1.8 92.71,31.75 73.66,31.75 v73.66,41.91 | v73.66,45.72 7432.13
RB  (via drill 0.35)
  Top 0.61: v46.99,31.75 47.25,31.49 2.14 | v54.61,34.29 54.61,29.21 v60.96,29.21 | v67.31,38.1 68.58,38.1 v69.85,36.83 | v102.87,36.83 v106.68,36.83
  Bottom 0.61: v46.99,31.75 46.99,33.02 PULL5.1 49.53,34.29 v54.61,34.29 | v60.96,29.21 67.31,29.21 v67.31,38.1 | v69.85,36.83 7432.5 72.39,38.1 72.39,27.94 80.01,27.94 81.28,29.21 95.25,29.21 96.52,30.48 96.52,34.29 99.06,36.83 v102.87,36.83 | v106.68,36.83 106.68,39.37 113.03,45.72 113.03,59.69 111.76,60.96 110.49,60.96 110.49,73.66 111.76,74.93 121.92,74.93 121.92,80.7 BRAKE.2
RB1  (via drill 0.35)
  Top 0.61: v15.24,17.78 35.56,17.78 v36.83,16.51 | v93.98,53.34 88.9,48.26 88.9,27.94 87.63,26.67 54.61,26.67 v54.61,21.59
  Top 0.813: v84.45,71.76 87.63,74.93 v87.63,78.74
  Bottom 0.152: RBRAKE.1 8,17.78
  Bottom 0.61: RES52.1 RES53.2 | RES91.1 88.9,88.9 88.9,85.09 RES92.1 RES93.2 86.36,78.74 v87.63,78.74 | RES52.1 43.18,17.78 44.45,19.05 44.45,20.32 45.72,21.59 RES51.1 v54.61,21.59 | v84.45,71.76 82.55,69.85 RES81.1 87.63,68.58 88.9,67.31 88.9,62.23 90.17,60.96 RES83.2 RES82.1 v93.98,53.34 | 8,17.78 v15.24,17.78 | v36.83,16.51 RES52.1
RBS
  Bottom 0.61: 7432_1.6 88.9,35.56 88.9,38.1 7432_1.10
RBS1  (via drill 0.35)
  Top 0.152: 3.14 73.38,74.34 72.7,73.66 72.7,73.53 72.39,73.23 v72.39,72.39
  Top 0.61: v83.82,41.91 82.55,41.91 82.55,46.99 77.47,46.99 74.93,49.53 v74.93,52.07 | v72.39,53.34 73.66,54.61 v73.66,55.88
  Bottom 0.61: v72.39,72.39 72.39,67.31 PULL8.1 71.12,63.5 72.39,63.5 73.66,62.23 v73.66,55.88 | 7432_1.4 85.09,41.91 v83.82,41.91 | v74.93,52.07 73.66,52.07 v72.39,53.34
RBS2  (via drill 0.35)
  Top 0.152: 3.13 75.16,73.66 73.66,73.66
  Top 0.61: 73.66,73.66 73.66,71.12 72.39,71.12 72.39,68.58 v67.31,68.58 | v81.28,50.8 76.2,55.88 74.93,55.88 71.12,59.69 71.12,60.96 v67.31,60.96
  Bottom 0.61: v67.31,68.58 PULL9.1 v67.31,60.96 | 7432_1.5 83.82,38.1 82.55,39.37 82.55,49.53 v81.28,50.8
SCS  (via drill 0.35)
  Top 0.61: v80.01,8.89 v80.01,25.4 | v80.01,40.64 81.28,40.64 82.55,39.37 v82.55,27.94
  Bottom 0.61: 50K9.A 50K9.S | DCNRES1.1 62.23,11.43 67.31,11.43 DCNPULL.2 50K9.A | 50K9.A 82.55,11.43 82.55,8.89 v80.01,8.89 | v80.01,25.4 IC4.8 v82.55,27.94 | 7432.11 v80.01,40.64
THR  (via drill 0.35)
  Top 0.152: 41.28,29.84 2.1
  Top 0.61: v39.37,31.75 41.28,29.84 | v111.76,62.23 110.49,60.96 96.52,60.96 93.98,58.42 80.01,58.42 v78.74,57.15 | v68.58,54.61 v57.15,54.61
  Bottom 0.61: v39.37,31.75 PULL3.1 44.45,36.83 44.45,38.1 52.07,38.1 53.34,39.37 53.34,45.72 55.88,48.26 7408.1 v57.15,54.61 | TRG-THR.2 124.79,75.64 124.79,74.79 122.39,72.39 111.76,72.39 v111.76,62.23 | v78.74,57.15 76.2,54.61 v68.58,54.61
TPS1  (via drill 0.35)
  Top 0.61: v29.21,43.18 v29.21,40.64 | v13.97,41.91 13.97,46.99 12.7,48.26
  Top 0.813: v22.86,81.28 13.97,81.28 12.7,80.01 12.7,48.26
  Bottom 0.61: RES24.2 RES22.1 RES21.1 | RES24.2 22.86,50.8 v13.97,41.91 | RES24.2 27.94,50.8 29.21,49.53 v29.21,43.18 | v29.21,40.64 33.02,40.64 34.29,39.37 RES32.1 RES33.2 29.21,34.29 29.21,29.21 27.94,29.21 RES31.1 20.32,25.4 13.97,31.75 v13.97,41.91 | TPS.1 8,44.45 11.43,44.45 v13.97,41.91
  Bottom 0.813: RES13.2 RES12.1 RES11.1 v22.86,81.28
TRG  (via drill 0.35)
  Top 0.61: v59.69,41.91 62.23,39.37 62.23,29.21 69.85,29.21 | 69.85,29.21 74.93,29.21 74.93,39.37 v76.2,39.37 | v127,72.39 127,63.5 125.73,62.23 v121.92,62.23 | v121.92,55.88 123.16,54.64 123.16,6.98 109.12,6.98 106.26,6.98 | 102,6.98 71.75,6.98 71.12,7.62 58.42,7.62 58.42,25.4 v69.85,25.4 | 102,6.98 106.26,6.98 | v69.85,27.94 69.85,29.21 | 106.26,6.98 | 102,6.98
  Bottom 0.61: 7408.3 58.42,43.18 v59.69,41.91 | v76.2,39.37 77.47,39.37 7432.10 | TRG-THR.1 127,74.35 v127,72.39 | v121.92,62.23 v121.92,55.88 | v69.85,25.4 v69.85,27.94
TS1  (via drill 0.35)
  Top 0.152: 1.1 20.95,70.48
  Top 0.61: 20.95,70.48 21.59,71.12 21.59,74.93 v29.21,74.93 | v69.85,53.34 46.99,53.34 41.91,58.42 41.91,72.39 v40.64,73.66
  Bottom 0.61: v29.21,74.93 35.56,74.93 PULL1.1 v40.64,73.66 | v69.85,53.34 71.12,52.07 7432.1
TS2  (via drill 0.35)
  Top 0.152: 1.2 18.81,69.85 21.59,69.85
  Top 0.61: 21.59,69.85 22.86,71.12 22.86,73.66 v29.21,73.66 29.21,68.58 39.37,68.58 39.37,54.61 41.91,52.07 67.31,52.07 68.58,50.8 v68.58,45.72
  Bottom 0.61: v29.21,73.66 PULL2.1 | 7432.2 v68.58,45.72
TSC
  Bottom 0.61: 7432.9 76.2,38.1 74.93,38.1 74.93,43.18 7432.3
VCC  (via drill 0.35)
  Top 0.152: v72.39,76.2 72.39,73.66 71.72,72.99 3.3 69.34,72.74 68.7,72.74 68.65,72.7 66.04,72.7 66.04,73.66
  Top 0.203: 2.3 43.85,28.54 v44.45,27.94
  Top 0.61: v15.24,35.56 v15.24,21.59 | v59.69,73.66 66.04,73.66 | 15.84,69.18 1.3 | v93.98,86.36 101.6,86.36 101.6,91.44 111.76,91.44 v113.03,90.17 | v120.65,34.29 109.22,34.29 v109.22,49.53 | v102.87,45.72 v102.87,49.53 | v41.91,46.99 v36.83,46.99 36.83,30.48 38.77,28.54 2.3 | v49.53,22.86 v49.53,20.32 | v71.12,53.34 69.85,54.61 v69.85,58.42
  Top 0.813: v22.86,82.55 v29.21,82.55 | v15.24,68.58 15.84,69.18 | v55.88,76.2 v59.69,76.2
  Bottom 0.152: 83.82,55.88 RES82.2 | 17.78,19.05 POT4.A
  Bottom 0.61: 17.78,86.36 POT1.A | PULL2.2 PULL1.2 35.56,54.61 RES22.2 33.02,53.34 31.75,53.34 30.48,52.07 30.48,46.99 RES23.2 | RES72.2 57.15,64.77 57.15,57.15 RES74.2 52.07,46.99 PULL5.2 PULL4.2 PULL3.2 41.91,44.45 v41.91,46.99 | PULL9.2 PULL8.2 71.12,57.15 v69.85,58.42 | 7408.14 67.31,48.26 PULL9.2 | POT5.A 52.07,13.97 RES52.2 | RES52.2 45.72,15.24 43.18,15.24 43.18,12.7 RES42.2 | RES23.2 34.29,41.91 27.94,41.91 RES32.2 19.05,38.1 POT3.A v15.24,35.56 | OCTPULL.2 110.49,17.78 110.49,24.13 116.84,24.13 118.11,25.4 118.11,30.48 7404.14 v120.65,34.29 | 83.82,55.88 78.74,50.8 7432.14 72.39,48.26 72.39,52.07 v71.12,53.34 | 93.98,73.66 RES94.2 91.44,77.47 90.17,78.74 90.17,83.82 92.71,83.82 RES92.2 v93.98,86.36 | 85.09,73.66 77.47,66.04 POT8.A 78.74,66.04 87.63,66.04 87.63,57.15 RES82.2 88.9,52.07 88.9,48.26 7432_1.14 95.25,48.26 95.25,43.18 96.2,43.18 IC5.4 102.87,41.91 v102.87,45.72 | v15.24,21.59 17.78,19.05 | RES72.2 62.23,66.04 60.96,67.31 59.69,67.31 v59.69,73.66 | v113.03,90.17 555RES9.2 | v109.22,49.53 IC5.8 v102.87,49.53 | v36.83,46.99 RES23.2 | v44.45,27.94 45.72,26.67 45.72,24.13 46.99,22.86 v49.53,22.86 | v49.53,20.32 49.53,19.05 RES52.2 | v22.86,82.55 20.32,85.09 POT1.A | POT1.A 15.24,85.09 v15.24,68.58 | RES72.2 64.77,62.23 64.77,59.69 66.04,58.42 67.31,58.42 PULL9.2
  Bottom 0.813: 17.78,86.36 8.89,86.36 IC7.3 | PULL7.2 PULL6.2 73.66,86.36 73.66,77.47 v72.39,76.2 | 85.09,73.66 93.98,73.66 | v29.21,82.55 31.75,82.55 RES12.2 POT6.A 49.53,81.28 RES62.2 49.53,78.74 49.53,77.47 50.8,76.2 v55.88,76.2 | POWER.1 13.39,62.23 15.24,62.23 v15.24,68.58 | v59.69,76.2 v59.69,73.66
(copper drawn outside any net)
  shapes: Route3 area x2883, Route4 area x2410, Route6 area x4527, Top area x3463

### Text on the board
Top: Atharva K, Mihir C, / Sahil S, Aryan J, Atharva T, Dattaram M
Route6: C:/Users/TheStreak/Downloads/Black Trans.bmp
Bottom: Atharva K, Mihir C, / Sahil S, Aryan J, Atharva T, Dattaram M | C:/Users/TheStreak/Downloads/Black Trans.bmp